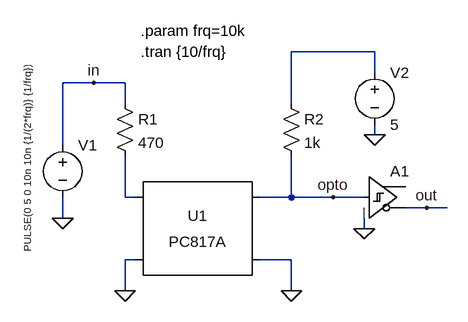
[diagram p0: schematic 18-pc817_group_delay.asc]
18-pc817_group_delay.asc, the LTspice schematic file:
Version 4
SHEET 1 880 680
WIRE 624 32 496 32
WIRE 624 64 624 32
WIRE 192 80 144 80
WIRE 240 80 192 80
WIRE 240 112 240 80
WIRE 496 112 496 32
WIRE 624 160 624 144
WIRE 144 176 144 80
WIRE 240 256 240 192
WIRE 256 256 240 256
WIRE 496 256 496 192
WIRE 496 256 448 256
WIRE 560 256 496 256
WIRE 608 256 560 256
WIRE 704 272 672 272
WIRE 736 272 704 272
WIRE 144 288 144 256
WIRE 608 304 608 288
WIRE 256 352 240 352
WIRE 496 352 448 352
WIRE 240 400 240 352
WIRE 496 400 496 352
FLAG 144 288 0
FLAG 240 400 0
FLAG 496 400 0
FLAG 624 160 0
FLAG 560 256 opto
FLAG 192 80 in
FLAG 608 304 0
FLAG 704 272 out
SYMBOL voltage 144 160 R0
WINDOW 3 -54 -104 VRight 1
WINDOW 123 0 0 Left 0
WINDOW 39 0 0 Left 0
SYMATTR InstName V1
SYMATTR Value PULSE(0 5 0 10n 10n {1/(2*frq)} {1/frq})
SYMBOL res 224 96 R0
SYMATTR InstName R1
SYMATTR Value 470
SYMBOL Optos\\PC817A 352 304 R0
SYMATTR InstName U1
SYMBOL res 480 96 R0
SYMATTR InstName R2
SYMATTR Value 1k
SYMBOL voltage 624 48 R0
WINDOW 123 0 0 Left 0
WINDOW 39 0 0 Left 0
SYMATTR InstName V2
SYMATTR Value 5
SYMBOL Digital\\schmitt 608 192 R0
SYMATTR InstName A1
TEXT 264 32 Left 2 !.tran {10/frq}
TEXT 264 0 Left 2 !.param frq=10k

The netlist it stands for:
* 18-pc817_group_delay.asc
V1 in 0 PULSE(0 5 0 10n 10n {1/(2*frq)} {1/frq})
R1 in N002 470
XU1 N002 0 opto 0 PC817 Igain=1m
R2 N001 opto 1k
V2 N001 0 5
A1 opto 0 0 0 0 out 0 0 SCHMITT
.tran {10/frq}
.param frq=10k
.lib PC817.sub
.backanno
.end

* Results of the author's LTspice run, read from the files saved beside the schematic
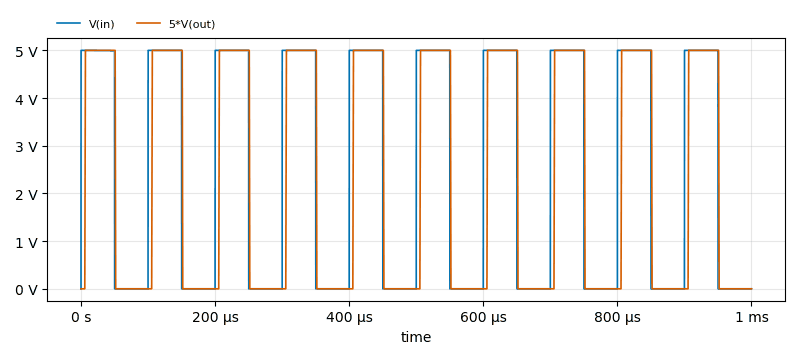
[diagram p1: Transient Analysis of 18-pc817_group_delay.asc, plotted from the saved traces]
* Transient Analysis, 1 run:
*   V(in): min 0 V, max 5 V, average 2.5 V, rms 3.536 V, last 0 V
*   5*V(out): min 0 V, max 5 V, average 2.272 V, rms 3.37 V, last 0 V